# Altium schematic sheet SheetPIC80_A9379.SchDoc
size A2
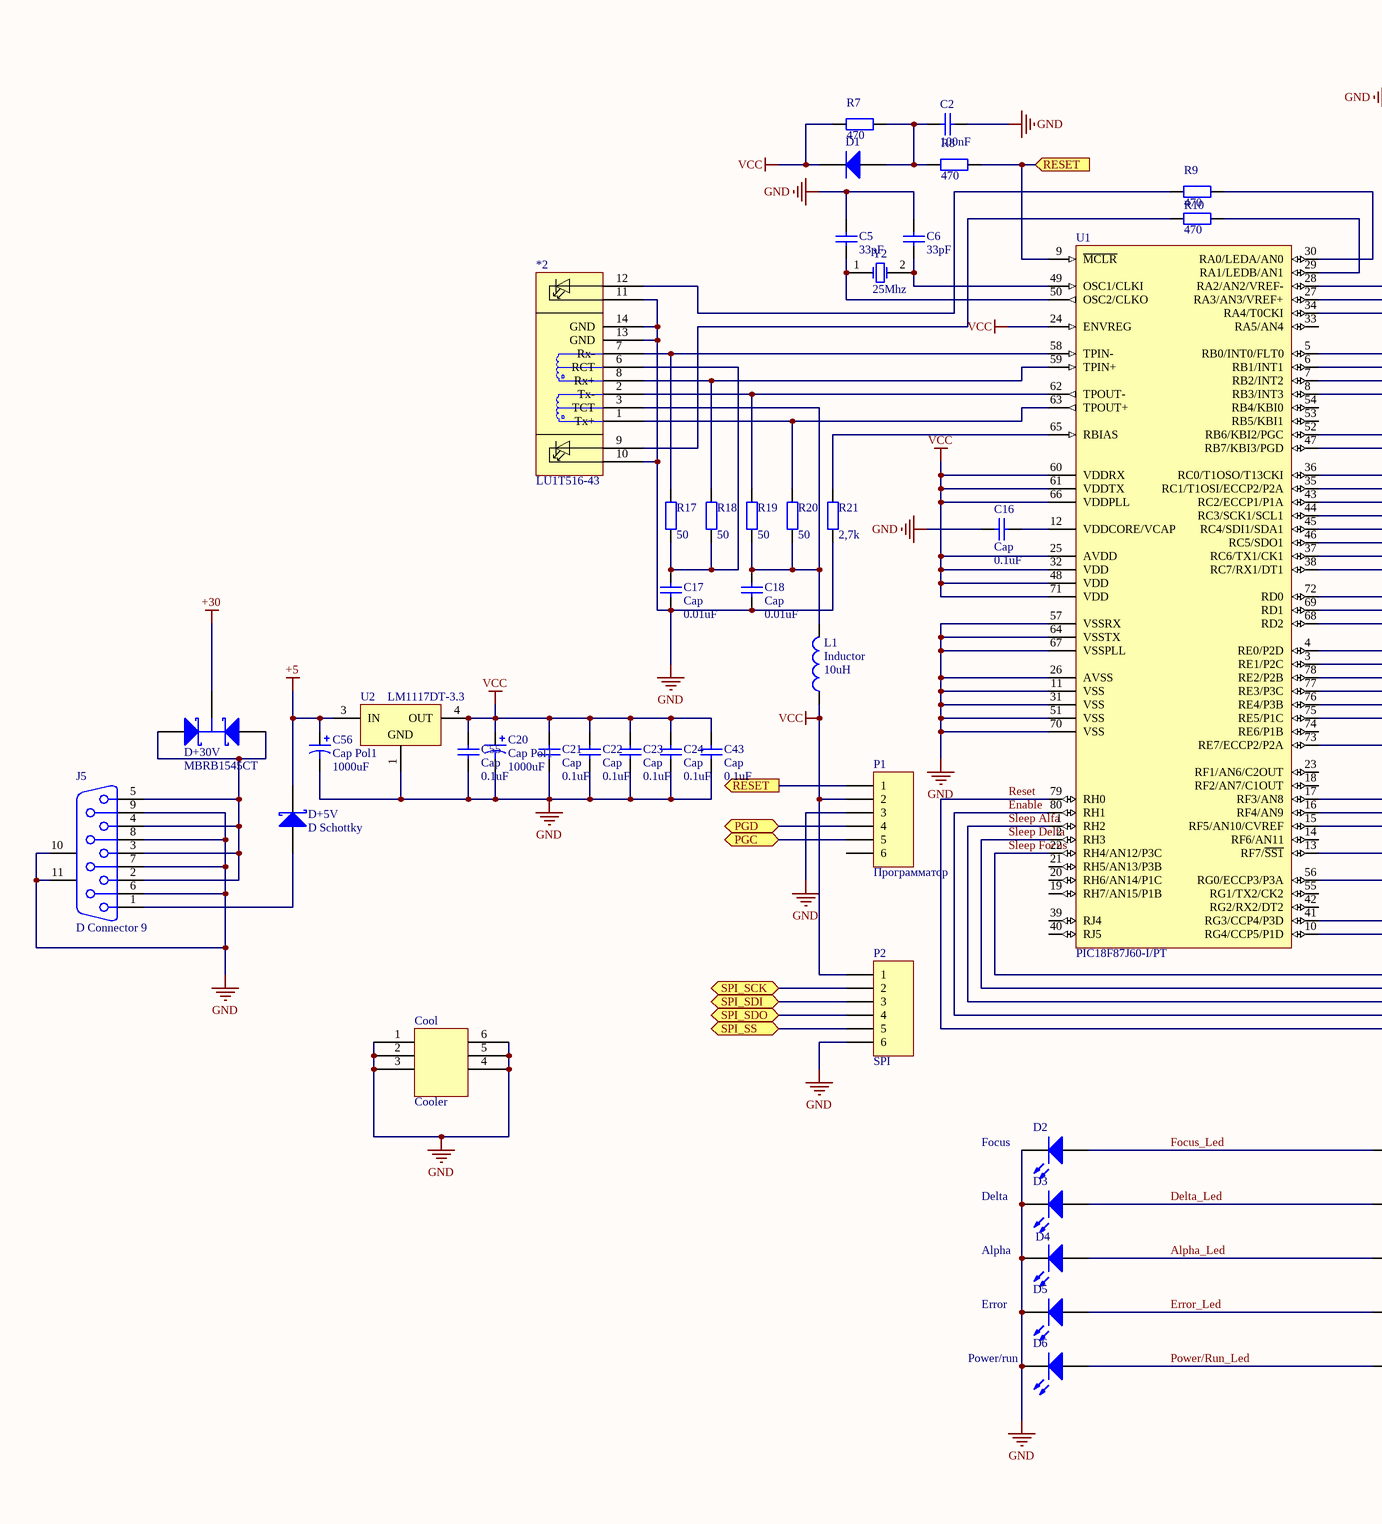
[diagram p0: SheetPIC80_A9379.SchDoc, left]
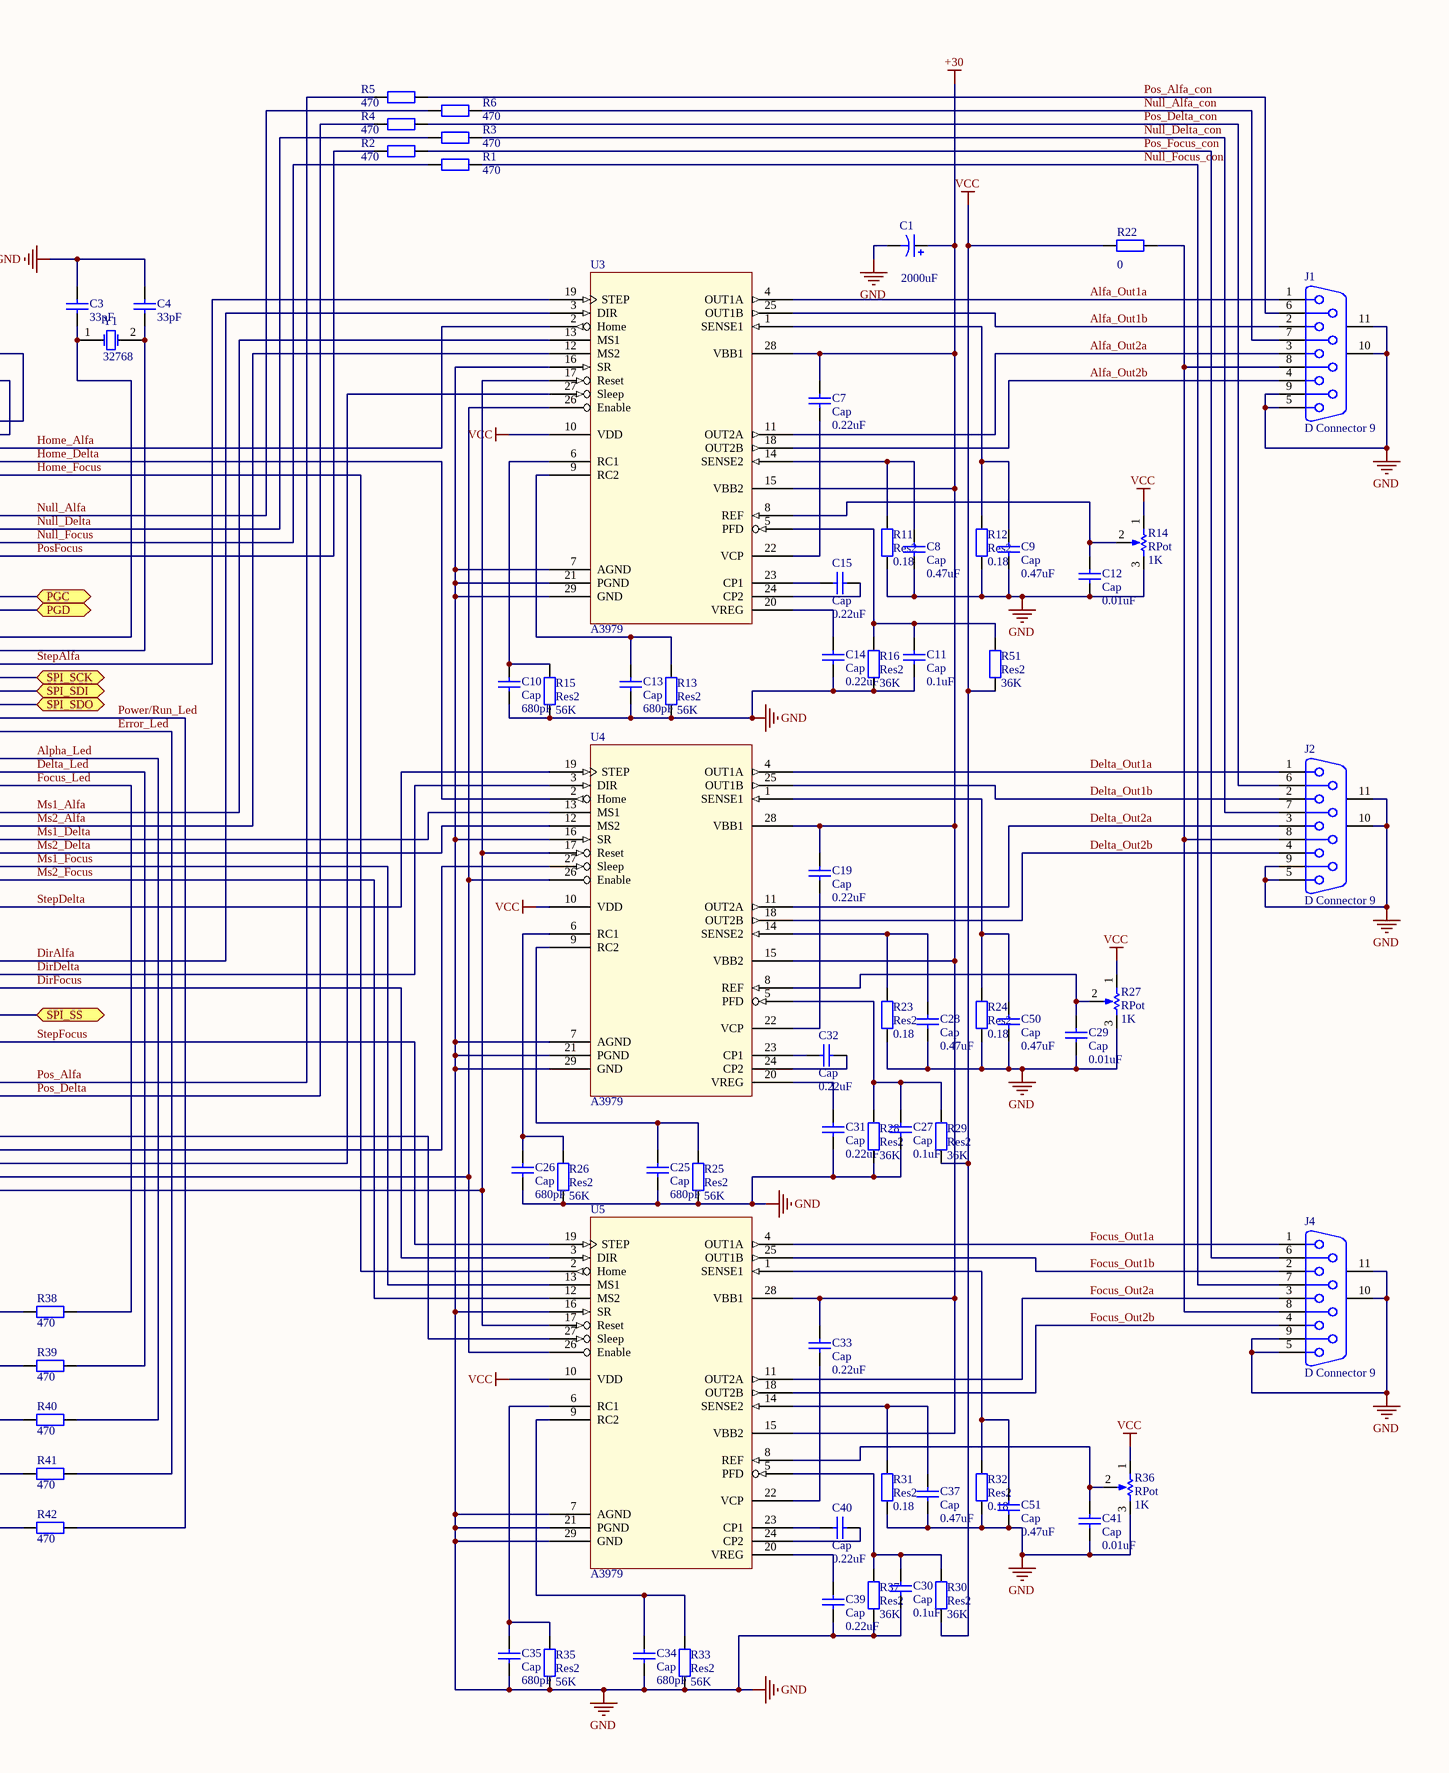
[diagram p1: SheetPIC80_A9379.SchDoc, right]

## Parts
*2  LU1T516-43  [EthernetCON]
C1  value 2000uF  [CAPPR7.5-16x35]  (hidden comment: Cap Pol1)
C2  value 100nF  [CAPC3225L]  (hidden comment: Cap)
C3  value 33pF  [CAPC2012L]  (hidden comment: Cap)
C4  value 33pF  [CAPC2012L]  (hidden comment: Cap)
C5  value 33pF  [CAPC2012L]  (hidden comment: Cap)
C6  value 33pF  [CAPC2012L]  (hidden comment: Cap)
C7  Cap  value 0.22uF  [CAPC3225L]
C8  Cap  value 0.47uF  [CAPC3225L]
C9  Cap  value 0.47uF  [CAPC3225L]
C10  Cap  value 680pF  [CAPC2012L]
C11  Cap  value 0.1uF  [CAPC3225L]
C12  Cap  value 0.01uF  [CAPC2012L]
C13  Cap  value 680pF  [CAPC2012L]
C14  Cap  value 0.22uF  [CAPC3225L]
C15  Cap  value 0.22uF  [CapC3225L]
C16  Cap  value 0.1uF  [CAPC3225L]
C17  Cap  value 0.01uF  [CAPC3225L]
C18  Cap  value 0.01uF  [CAPC3225L]
C19  Cap  value 0.22uF  [CAPC3225L]
C20  Cap Pol1  value 1000uF  [CAPPR5-5x5]
C21  Cap  value 0.1uF  [CAPC3225L]
C22  Cap  value 0.1uF  [CAPC3225L]
C23  Cap  value 0.1uF  [CAPC3225L]
C24  Cap  value 0.1uF  [CAPC3225L]
C25  Cap  value 680pF  [CAPC2012L]
C26  Cap  value 680pF  [CAPC2012L]
C27  Cap  value 0.1uF  [CAPC3225L]
C28  Cap  value 0.47uF  [CAPC3225L]
C29  Cap  value 0.01uF  [CAPC2012L]
C30  Cap  value 0.1uF  [CAPC3225L]
C31  Cap  value 0.22uF  [CAPC3225L]
C32  Cap  value 0.22uF  [CAPC3225L]
C33  Cap  value 0.22uF  [CAPC3225L]
C34  Cap  value 680pF  [CAPC2012L]
C35  Cap  value 680pF  [CAPC2012L]
C37  Cap  value 0.47uF  [CAPC3225M]
C39  Cap  value 0.22uF  [CAPC3225L]
C40  Cap  value 0.22uF  [CAPC3225L]
C41  Cap  value 0.01uF  [CAPC2012L]
C43  Cap  value 0.1uF  [CAPC3225L]
C50  Cap  value 0.47uF  [CAPC3225L]
C51  Cap  value 0.47uF  [CAPC3225L]
C55  Cap  value 0.1uF  [CAPC3225L]
C56  Cap Pol1  value 1000uF  [CAPPR5-5x5]
Cool  Cooler  [PCBComponent_1 - duplicate]
D1  Diode  [SOT95P240-3N]  (value not drawn)
D2  Focus  [LED-1]
D3  Delta  [LED-1]
D4  Alpha  [LED-1]
D5  Error  [LED-1]
D6  Power/run  [LED-1]
D+5V  D Schottky  [SOD-323]
D+30V  MBRB1545CT  [D2PAK]
J1  D Connector 9  [D-SUB-9]
J2  D Connector 9  [D-SUB-9]
J4  D Connector 9  [D-SUB-9]
J5  D Connector 9  [D-SUB-9]
L1  Inductor  value 10uH  [INDC3216AL]
P1  Программатор  [HDR1X6]
P2  SPI  [HDR1X6]
R1  value 470  [RESC2012M]  (hidden comment: Res2)
R2  value 470  [RESC2012M]  (hidden comment: Res2)
R3  value 470  [RESC2012M]  (hidden comment: Res2)
R4  value 470  [RESC2012M]  (hidden comment: Res2)
R5  value 470  [RESC2012M]  (hidden comment: Res2)
R6  value 470  [RESC2012M]  (hidden comment: Res2)
R7  value 470  [RESC2012M]  (hidden comment: Res2)
R8  value 470  [RESC2012M]  (hidden comment: Res2)
R9  value 470  [RESC2012M]  (hidden comment: Res2)
R10  value 470  [RESC2012M]  (hidden comment: Res2)
R11  Res2  value 0.18  [RESC6332L]
R12  Res2  value 0.18  [RESC6332L]
R13  Res2  value 56K  [RESC2012M]
R14  RPot  value 1K  [VR5]
R15  Res2  value 56K  [RESC2012M]
R16  Res2  value 36K  [RESC2012M]
R17  value 50  [RESC2012M]  (hidden comment: Res2)
R18  value 50  [RESC2012M]  (hidden comment: Res2)
R19  value 50  [RESC2012M]  (hidden comment: Res2)
R20  value 50  [RESC2012M]  (hidden comment: Res2)
R21  value 2,7k  [RESC2012M]  (hidden comment: Res2)
R22  value 0  [RESC2012M]  (hidden comment: Res2)
R23  Res2  value 0.18  [RESC6332L]
R24  Res2  value 0.18  [RESC6332L]
R25  Res2  value 56K  [RESC2012M]
R26  Res2  value 56K  [RESC2012M]
R27  RPot  value 1K  [VR5]
R28  Res2  value 36K  [RESC2012M]
R29  Res2  value 36K  [RESC2012M]
R30  Res2  value 36K  [RESC2012M]
R31  Res2  value 0.18  [RESC6332L]
R32  Res2  value 0.18  [RESC6332L]
R33  Res2  value 56K  [RESC2012M]
R35  Res2  value 56K  [RESC2012M]
R36  RPot  value 1K  [VR5]
R37  Res2  value 36K  [RESC2012M]
R38  value 470  [RESC2012M]  (hidden comment: Res2)
R39  value 470  [RESC2012M]  (hidden comment: Res2)
R40  value 470  [RESC2012M]  (hidden comment: Res2)
R41  value 470  [RESC2012M]  (hidden comment: Res2)
R42  value 470  [RESC2012M]  (hidden comment: Res2)
R51  Res2  value 36K  [RESC2012M]
U1  PIC18F87J60-I/PT  [TQFP-PT80_N]
U2  LM1117DT-3.3  [TD03B_N]
U3  A3979  [TSOP65P640_HS-28AM - duplicate]
U4  A3979  [TSOP65P640_HS-28AM - duplicate]
U5  A3979  [TSOP65P640_HS-28AM - duplicate]
Y1  value 32768  [Quartz]  (hidden comment: XTAL)
Y2  value 25Mhz  [Quartz]  (hidden comment: XTAL)

## Ports
PGC (bidir), PGD (bidir), RESET (in), RESET (out), SPI_SCK (bidir), SPI_SDI (bidir), SPI_SDO (bidir), SPI_SS (bidir)

## Nets
+5: C56.1 D+5V.2(K) U2.3(IN)
+30: C1.1 C7.2 C19.2 C33.2 D+30V.2(K) U3.15(VBB2) U3.28(VBB1) U4.15(VBB2) U4.28(VBB1) U5.15(VBB2) U5.28(VBB1)
GND: *2.10 *2.11 *2.13(GND) *2.14(GND) C1.2 C2.1 C3.2 C4.1 C5.2 C6.1 C8.1 C9.1 C10.1 C11.1 C12.1 C13.1 C14.1 C16.2 C17.1 C18.1 C20.2 C21.2 C22.2 C23.2 C24.2 C25.1 C26.1 C27.1 C28.1 C29.1 C30.1 C31.1 C34.1 C35.1 C37.1 C39.1 C41.1 C43.2 C50.1 C51.1 C55.2 C56.2 Cool.1 Cool.2 Cool.3 Cool.4 Cool.5 Cool.6 D2.2(K) D3.2(K) D4.2(K) D5.2(K) D6.2(K) J1.5 J1.9 J1.10(MH1) J1.11(MH2) J2.5 J2.9 J2.10(MH1) J2.11(MH2) J4.5 J4.9 J4.10(MH1) J4.11(MH2) J5.6 J5.7 J5.8 J5.9 J5.10(MH1) J5.11(MH2) P1.3 P2.6 R11.1 R12.1 R13.1 R14.3(BOT) R15.1 R16.1 R21.1 R23.1 R24.1 R25.1 R26.1 R27.3(BOT) R28.1 R31.1 R32.1 R33.1 R35.1 R36.3(BOT) R37.1 U1.11(VSS) U1.26(AVSS) U1.31(VSS) U1.51(VSS) U1.57(VSSRX) U1.64(VSSTX) U1.67(VSSPLL) U1.70(VSS) U2.1(GND) U3.7(AGND) U3.16(SR) U3.21(PGND) U3.29(GND) U4.7(AGND) U4.16(SR) U4.21(PGND) U4.29(GND) U5.7(AGND) U5.16(SR) U5.21(PGND) U5.29(GND)
VCC: C20.1 C21.1 C22.1 C23.1 C24.1 C43.1 C55.1 D1.2(K) L1.1 P1.2 P2.1 R7.2 R14.1(TOP) R22.1 R27.1(TOP) R29.1 R30.1 R36.1(TOP) R51.1 U1.24(ENVREG) U1.25(AVDD) U1.32(VDD) U1.48(VDD) U1.60(VDDRX) U1.61(VDDTX) U1.66(VDDPLL) U1.71(VDD) U2.4(OUT) U3.10(VDD) U4.10(VDD) U5.10(VDD)
Alfa_Out1a: J1.1 U3.4(OUT1A)
Alfa_Out1b: J1.2 U3.25(OUT1B)
Alfa_Out2a: J1.3 U3.11(OUT2A)
Alfa_Out2b: J1.4 U3.18(OUT2B)
Alpha_Led: D4.1(A) R40.1 R40.2 U1.72(RD0)
Delta_Led: D3.1(A) R39.1 R39.2 U1.69(RD1)
Delta_Out1a: J2.1 U4.4(OUT1A)
Delta_Out1b: J2.2 U4.25(OUT1B)
Delta_Out2a: J2.3 U4.11(OUT2A)
Delta_Out2b: J2.4 U4.18(OUT2B)
DirAlfa: U1.17(RF3/AN8) U3.3(DIR)
DirDelta: U1.16(RF4/AN9) U4.3(DIR)
DirFocus: U1.15(RF5/AN10/CVREF) U5.3(DIR)
Enable: U1.80(RH1) U3.26(Enable) U4.26(Enable) U5.26(Enable)
Error_Led: D5.1(A) R41.1 R41.2 U1.38(RC7/RX1/DT1)
Focus_Led: D2.1(A) R38.1 R38.2 U1.68(RD2)
Focus_Out1a: J4.1 U5.4(OUT1A)
Focus_Out1b: J4.2 U5.25(OUT1B)
Focus_Out2a: J4.3 U5.11(OUT2A)
Focus_Out2b: J4.4 U5.18(OUT2B)
Home_Alfa: U1.28(RA2/AN2/VREF-) U3.2(Home)
Home_Delta: U1.27(RA3/AN3/VREF+) U4.2(Home)
Home_Focus: U1.34(RA4/T0CKI) U5.2(Home)
Ms1_Alfa: U1.4(RE0/P2D) U3.13(MS1)
Ms1_Delta: U1.78(RE2/P2B) U4.13(MS1)
Ms1_Focus: U1.76(RE4/P3B) U5.13(MS1)
Ms2_Alfa: U1.3(RE1/P2C) U3.12(MS2)
Ms2_Delta: U1.77(RE3/P3C) U4.12(MS2)
Ms2_Focus: U1.75(RE5/P1C) U5.12(MS2)
Null_Alfa: R6.2 U1.5(RB0/INT0/FLT0)
Null_Alfa_con: J1.7 R6.1
Null_Delta: R3.2 U1.6(RB1/INT1)
Null_Delta_con: J2.7 R3.1
Null_Focus: R1.2 U1.7(RB2/INT2)
Null_Focus_con: J4.7 R1.1
PGC: P1.5 U1.52(RB6/KBI2/PGC) ; port PGC
PGD: P1.4 U1.47(RB7/KBI3/PGD) ; port PGD
Pos_Alfa: R5.2 U1.41(RG3/CCP4/P3D)
Pos_Alfa_con: J1.6 R5.1
Pos_Delta: R4.2 U1.10(RG4/CCP5/P1D)
Pos_Delta_con: J2.6 R4.1
Pos_Focus_con: J4.6 R2.1
PosFocus: R2.2 U1.8(RB3/INT3)
Power/Run_Led: D6.1(A) R42.1 R42.2 U1.37(RC6/TX1/CK1)
RESET: P1.1 R8.1 U1.9(~{MCLR}) ; port RESET
Reset: U1.79(RH0) U3.17(Reset) U4.17(Reset) U5.17(Reset)  [a separate net that carries the same name]
Sleep Alfa: U1.1(RH2) U3.27(Sleep)
Sleep Delta: U1.2(RH3) U4.27(Sleep)
Sleep Focus: U1.22(RH4/AN12/P3C) U5.27(Sleep)
SPI_SCK: P2.2 U1.44(RC3/SCK1/SCL1) ; port SPI_SCK
SPI_SDI: P2.3 U1.45(RC4/SDI1/SDA1) ; port SPI_SDI
SPI_SDO: P2.4 U1.46(RC5/SDO1) ; port SPI_SDO
SPI_SS: P2.5 U1.13(RF7/~{SS1}) ; port SPI_SS
StepAlfa: U1.43(RC2/ECCP1/P1A) U3.19(STEP)
StepDelta: U1.73(RE7/ECCP2/P2A) U4.19(STEP)
StepFocus: U1.56(RG0/ECCP3/P3A) U5.19(STEP)
Net*2_1: *2.1(Tx+) R20.2 U1.63(TPOUT+)
Net*2_2: *2.2(Tx-) R19.2 U1.62(TPOUT-)
Net*2_3: *2.3(TCT) C18.2 L1.2 R19.1 R20.1
Net*2_6: *2.6(RCT) C17.2 R17.1 R18.1
Net*2_7: *2.7(Rx-) R17.2 U1.58(TPIN-)
Net*2_8: *2.8(Rx+) R18.2 U1.59(TPIN+)
Net*2_9: *2.9 R10.2
Net*2_12: *2.12 R9.2
NetC2_2: C2.2 D1.1(A) R7.1 R8.2
NetC3_1: C3.1 U1.36(RC0/T1OSO/T13CKI) Y1.1(OSC1)
NetC4_2: C4.2 U1.35(RC1/T1OSI/ECCP2/P2A) Y1.2(OSC2)
NetC5_1: C5.1 U1.50(OSC2/CLKO) Y2.1(OSC1)
NetC6_2: C6.2 U1.49(OSC1/CLKI) Y2.2(OSC2)
NetC7_1: C7.1 U3.22(VCP)
NetC8_2: C8.2 R11.2 U3.14(SENSE2)
NetC9_2: C9.2 R12.2 U3.1(SENSE1)
NetC10_2: C10.2 R15.2 U3.6(RC1)
NetC11_2: C11.2 R16.2 R51.2 U3.5(PFD)
NetC12_2: C12.2 R14.2(TAP) U3.8(REF)
NetC13_2: C13.2 R13.2 U3.9(RC2)
NetC14_2: C14.2 U3.20(VREG)
NetC15_1: C15.1 U3.24(CP2)
NetC15_2: C15.2 U3.23(CP1)
NetC16_1: C16.1 U1.12(VDDCORE/VCAP)
NetC19_1: C19.1 U4.22(VCP)
NetC25_2: C25.2 R25.2 U4.9(RC2)
NetC26_2: C26.2 R26.2 U4.6(RC1)
NetC27_2: C27.2 R28.2 R29.2 U4.5(PFD)
NetC28_2: C28.2 R23.2 U4.14(SENSE2)
NetC29_2: C29.2 R27.2(TAP) U4.8(REF)
NetC30_2: C30.2 R30.2 R37.2 U5.5(PFD)
NetC31_2: C31.2 U4.20(VREG)
NetC32_1: C32.1 U4.24(CP2)
NetC32_2: C32.2 U4.23(CP1)
NetC33_1: C33.1 U5.22(VCP)
NetC34_2: C34.2 R33.2 U5.9(RC2)
NetC35_2: C35.2 R35.2 U5.6(RC1)
NetC37_2: C37.2 R31.2 U5.14(SENSE2)
NetC39_2: C39.2 U5.20(VREG)
NetC40_1: C40.1 U5.24(CP2)
NetC40_2: C40.2 U5.23(CP1)
NetC41_2: C41.2 R36.2(TAP) U5.8(REF)
NetC50_2: C50.2 R24.2 U4.1(SENSE1)
NetC51_2: C51.2 R32.2 U5.1(SENSE1)
NetD+5V_1: D+5V.1(A) J5.1
NetD+30V_1: D+30V.1(A1) D+30V.3(A2) J5.2 J5.3 J5.4 J5.5
NetJ1_8: J1.8 J2.8 J4.8 R22.2
NetR9_1: R9.1 U1.30(RA0/LEDA/AN0)
NetR10_1: R10.1 U1.29(RA1/LEDB/AN1)
NetR21_2: R21.2 U1.65(RBIAS)

Not connected (* = marked no-connect by the designer): P1 6; U1 14(RF6/AN11) 18(RF2/AN7/C1OUT) 19(RH7/AN15/P1B) 20(RH6/AN14/P1C) 21(RH5/AN13/P3B) 23(RF1/AN6/C2OUT) 33(RA5/AN4) 39(RJ4) 40(RJ5) 42(RG2/RX2/DT2) 53(RB5/KBI1) 54(RB4/KBI0) 55(RG1/TX2/CK2) 74(RE6/P1B)

## Library data of the parts
C1 C20 C56 = Cap Pol1: Polarized Capacitor (Radial); Published: 8-Jun-2000; LatestRevisionDate: 17-Jul-2002; LatestRevisionNote: Re-released for DXP Platform.; PackageReference: RB7.6-15; Publisher: Altium Limited
C2-C19 C21-C35 C37 C39-C41 C43 C50 C51 C55 = Cap: Capacitor; Published: 8-Jun-2000; LatestRevisionDate: 17-Jul-2002; LatestRevisionNote: Re-released for DXP Platform.; PackageReference: RAD-0.3; Publisher: Altium Limited
D1 = Diode: Default Diode; Published: 8-Jun-2000; LatestRevisionDate: 17-Jul-2002; LatestRevisionNote: Re-released for DXP Platform.; PackageVersion: Sep-1996; PackageReference: SMC; Publisher: Altium Limited; Code_JEDEC: DO-214-AB
D2-D6 = LED1: Typical RED GaAs LED; Published: 8-Jun-2000; LatestRevisionDate: 08-Jul-2005; LatestRevisionNote: Mech Layer 1 removed.; PackageReference: LED-1; Publisher: Altium Limited
D+5V = D Schottky: Schottky Diode; Published: 8-Jun-2000; LatestRevisionDate: 17-Jul-2002; LatestRevisionNote: Re-released for DXP Platform.; PackageReference: SMB; Publisher: Altium Limited; Code_JEDEC: DO-214-AA
D+30V = MBRB1545CT: Schottky Rectifier; Note: Terminal 2 is the TAB and is electrically connected to the cathode; Published: 8-Jun-2000; LatestRevisionDate: 17-Jul-2002; LatestRevisionNote: Re-released for DXP Platform.; DatasheetDocument: May-1998; PackageReference: D2PAK; Publisher: Altium Limited; ComponentLink1Description: Manufacturer Link; ComponentLink1URL: http://www.irf.com/; ComponentLink2Description: Datasheet; ComponentLink2URL: http://www.irf.com/product-info/datasheets/data/mbrb1535ct.pdf
J1 J2 J4 J5 = D Connector 9: Receptacle Assembly, 9 Position, Right Angle; PackageDocument: O; Positions: 9; Published: 15-Jun-2001; LatestRevisionDate: 17-Jul-2002; LatestRevisionNote: Re-released for DXP Platform.; DatasheetDocument: 1-Sep-1999; PackageReference: 788750; Publisher: Altium Limited; Orientation: Right Angle; Gender: Receptacle
L1 = Inductor: Code_IEC: 1005; Published: 8-Jun-2000; LatestRevisionDate: 29-May-2009; LatestRevisionNote: IPC-7351 Footprint Added.; PackageReference: 0402-A; Publisher: Altium Limited; PackageDescription: Chip Inductor; Code_JEITA: 0402
P1 P2 = Header 6: Header, 6-Pin; LatestRevisionDate: 17-Jul-2002; LatestRevisionNote: Re-released for DXP Platform.; Publisher: Altium Limited
R1-R13 R15-R26 R28-R33 R35 R37-R42 R51 = Res2: Resistor; Published: 8-Jun-2000; LatestRevisionDate: 17-Jul-2002; LatestRevisionNote: Re-released for DXP Platform.; PackageReference: AXIAL-0.4; Publisher: Altium Limited
R14 R27 R36 = RPot: Potentiometer; Sim Note: Enter the Resistance value and the set point into parameter fields.; Set Position: 0.5; Published: 8-Jun-2000; LatestRevisionDate: 17-Jul-2002; LatestRevisionNote: Re-released for DXP Platform.; PackageReference: VR5; Publisher: Altium Limited
U1 = PIC18F87J60-I/PT: High Performance, 1-Mbit Flash Microcontroller with Ethernet, 128K Flash, 80-Pin TQFP, Industrial Temperature Range; Published: 29-Jan-2009; DatasheetVersion: revD, Feb-2008; PackageVersion: revAW, Oct-2008; PackageReference: TQFP-PT80; Publisher: Altium Limited; PackageDescription: 80-Lead Thin Plastic Quad Flat Pack (PT) - 12x12x1mm Body, 2.00mm [TQFP]; Code_JEDEC: MS-026; ComponentLink1Description: Manufacturer Link; ComponentLink1URL: http://www.microchip.com; ComponentLink2Description: Datasheet; ComponentLink2URL: http://ww1.microchip.com/downloads/en/DeviceDoc/39762d.pdf; ComponentLink3Description: Packaging Specification; ComponentLink3URL: http://ww1.microchip.com/downloads/en/PackagingSpec/00049AW.pdf
U2 = LM1117DT-3.3: 800mA Low-Dropout Linear Regulator; Manufacturer: National Semiconductor; CompType: LDO IC; PackageTopMarking: NSUZXYTT*LM1117*DT-3.3; PowerWise: N; Published: 4-Dec-2008; DatasheetVersion: Apr-2006; PackageVersion: revC, Apr-2003; PackageReference: TD03B; Publisher: Altium Limited; PackageDescription: TO252, Molded, Jedec, 6.8 x 6.10 x 2.30mm Body, 3 Lead, 2.28mm Pitch, Surface Mount; PartNumber: LM1117DT-3.3; RoHS: O; PinCount: 3; DigiKeyPartNumber: LM1117DT-3.3-ND; Code_JEDEC: TO-252-AA; ComponentLink1Description: LM1117 Datasheet; ComponentLink1URL: http://www.national.com/ds/LM/LM1117.pdf; ComponentLink2Description: LM1117 Web Page; ComponentLink2URL: http://www.national.com/pf/LM/LM1117.html; ComponentLink3Description: TD03B Package Page; ComponentLink3URL: http://www.national.com/packaging/folders/td03b.html
U3-U5 = A3979: Microstepping DMOS Driver with Translator 2.5A
Y1 Y2 = XTAL: Crystal Oscillator; Published: 8-Jun-2000; LatestRevisionDate: 17-Jul-2002; LatestRevisionNote: Re-released for DXP Platform.; PackageReference: R38; Publisher: Altium Limited